# Altium schematic sheet MCU_NODE.SchDoc
size A
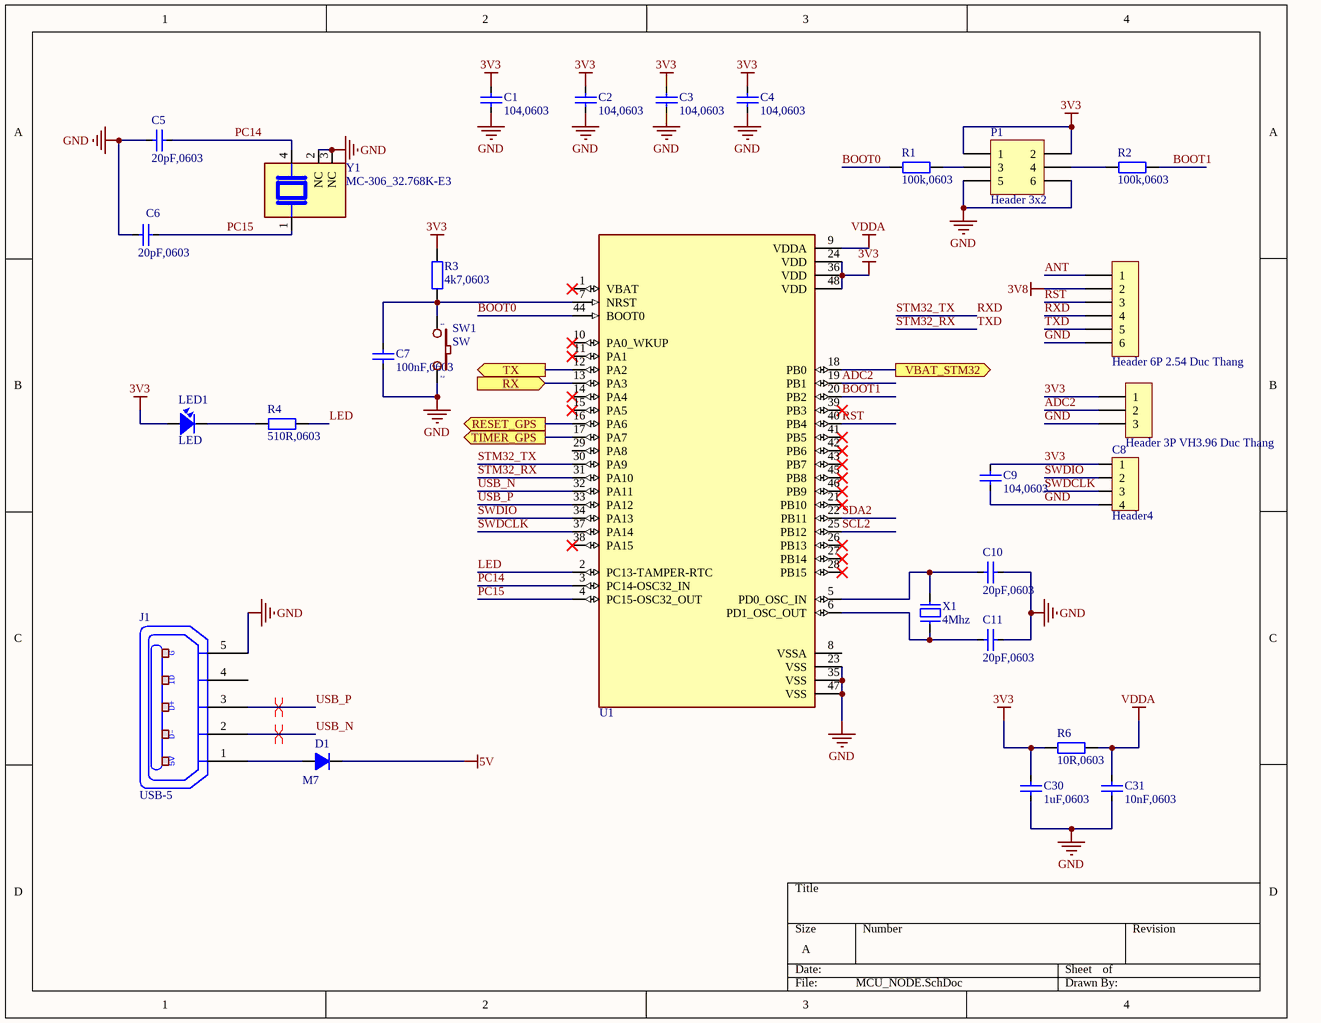
[diagram p0: MCU_NODE.SchDoc]

## Parts
C1  104,0603  [CAP_0603]
C2  104,0603  [CAP_0603]
C3  104,0603  [CAP_0603]
C4  104,0603  [CAP_0603]
C5  20pF,0603  [CAP_0603]
C6  20pF,0603  [CAP_0603]
C7  100nF,0603  [CAP_0603]
C8  Header4  [JP4-D1C]
C9  104,0603  [CAP_0603]
C10  20pF,0603  [CAP_0603]
C11  20pF,0603  [CAP_0603]
C30  1uF,0603  [CAP_0603]
C31  10nF,0603  [CAP_0603]
D1  M7  [SMA]
H1  Header 6P 2.54 Duc Thang  [XH2.54M-6]
H2  Header 3P VH3.96 Duc Thang  [VH3.96M-3]
J1  USB-5  [USB-M1]
LED1  LED  [LED-0805-Blue]
P1  Header 3x2  [Header 3x2]
R1  100k,0603  [RES-SMD-0603]
R2  100k,0603  [RES-SMD-0603]
R3  4k7,0603  [RES-SMD-0603]
R4  510R,0603  [RES-SMD-0603]
R6  10R,0603  [RES-SMD-0603]
SW1  SW  [SW-SMD]
U1  STM32  [LQFP 48]  (value not drawn)
X1  4Mhz  [XT2]
Y1  MC-306_32.768K-E3  [XTAL_MC-306_32.768K-E3]

## Ports
RESET_GPS (out), RX (in), TIMER_GPS (out), TX (out), VBAT_STM32 (out)

## Nets
3V3: C1.2 C2.2 C3.2 C4.2 C8.1 C9.2 C30.2 H2.1 LED1.1 P1.1 P1.2 R3.1 R6.1 U1.24(VDD) U1.36(VDD) U1.48(VDD)
3V8: H1.2
5V: D1.2(K)
GND: C1.1 C2.1 C3.1 C4.1 C5.1 C6.1 C7.1 C8.4 C9.1 C10.2 C11.2 C30.1 C31.1 H1.6 H2.3 J1.5(P5) P1.5 P1.6 SW1.2 U1.23(VSS) U1.35(VSS) U1.47(VSS) Y1.2(NC) Y1.3(NC)
VDDA: C31.2 R6.2 U1.9(VDDA)
ADC2: H2.2 U1.19(PB1)
ANT: H1.1
BOOT0: R1.1 U1.44(BOOT0)
BOOT1: R2.2 U1.20(PB2)
LED: R4.2 U1.2(PC13-TAMPER-RTC)
PC14: C5.2 U1.3(PC14-OSC32_IN) Y1.4
PC15: C6.2 U1.4(PC15-OSC32_OUT) Y1.1
RESET_GPS: U1.16(PA6) ; port RESET_GPS
RST: H1.3 U1.40(PB4)
RX: U1.13(PA3) ; port RX
RXD: H1.4 U1.30(PA9)  [also labelled STM32_TX]
SCL2: U1.25(PB12)
SDA2: U1.22(PB11)
STM32_RX: H1.5 U1.31(PA10)  [also labelled TXD]
SWDCLK: C8.3 U1.37(PA14)
SWDIO: C8.2 U1.34(PA13)
TIMER_GPS: U1.17(PA7) ; port TIMER_GPS
TX: U1.12(PA2) ; port TX
USB_N: J1.2(P2) U1.32(PA11)
USB_P: J1.3(P3) U1.33(PA12)
VBAT_STM32: U1.18(PB0) ; port VBAT_STM32
NetC7_2: C7.2 R3.2 SW1.1 U1.7(NRST)
NetC10_1: C10.1 U1.5(PD0_OSC_IN) X1.2
NetC11_1: C11.1 U1.6(PD1_OSC_OUT) X1.1
NetD1_1: D1.1(A) J1.1(P1)
NetLED1_2: LED1.2 R4.1
NetP1_3: P1.3 R1.2
NetP1_4: P1.4 R2.1

Not connected (* = marked no-connect by the designer): J1 4(P4); U1 1(VBAT)* 8(VSSA) 10(PA0_WKUP)* 11(PA1)* 14(PA4)* 15(PA5)* 21(PB10)* 26(PB13)* 27(PB14)* 28(PB15)* 29(PA8) 38(PA15)* 39(PB3)* 41(PB5)* 42(PB6)* 43(PB7)* 45(PB8)* 46(PB9)*

## Layout directives
differential pair: USB_N, USB_P

## Notes on the sheet
- (in symbol USB-5) G; ID; D+; D-; 5V

## Library data of the parts
C1-C7 C9-C11 C30 C31 = CapSMD: Capacitor; Value: 33p; Published: 8-Jun-2000; LatestRevisionDate: 17-Jul-2002; LatestRevisionNote: Re-released for DXP Platform.; PackageReference: RAD-0.3; Publisher: Altium Limited
C8 = Header4: Header IDC, 4 x 1 Pin Vertical 2.54mm Pitch (Non-Boxed, Male); Manufacturer: W¨¹rth Elektronik eiSos GmbH; partNo: 613002143121; ComponentLink1 Description: Manufacturer; ComponentLink2 Description: Datasheet; NoPins: 02; Created Date: 29 March 2013; ComponentLink1URL: http://www.we-online.com; ComponentLink2URL: http://katalog.we-online.de/em/datasheet/6130xx143121.pdf; Created by: Karrer Zheng
D1 = D1A: Diode 1A; Value: 1N4007
H1 = Header 6P 2.54 Duc Thang: Cắm; Ten_Linh_Kien: Header 6P XH2.54-6P Đực Thẳng; Don_Vi: Con; Ma_Hang: MH001972; Chung_Loai: Cắm
H2 = Header 3P VH3.96 Duc Thang: Cắm; Ten_Linh_Kien: Header 3P XH2.54-3P Đực Thẳng; Don_Vi: Con; Ma_Hang: MH001292; Chung_Loai: Cắm
J1 = USB-5: Manufacturer: FCI; Manufacturer Part Number: 10118193-0001LF; Connector Type: USB - micro B; Number of Contacts: 5; Gender: Receptacle; Specifications: USB 2.0; .Creator: MM; .Checked PCB: RF; Supplier 1: Digi-Key; RoHS: RoHS Compliant; Category: Connectors, Interconnects; Stock 1: 28642; Pricing 1: 1=0.46, 10=0.433, 25=0.3712, 50=0.3156, 100=0.3032, 250=0.27224, 500=0.25988 (USD); Packaging: Cut Tape (CT); Mounting Type: Surface Mount, Right Angle, Horizontal; Features: Shielded, Solder Retention; Ingress Protection: -; ComponentLink1URL: http://portal.fciconnect.com/Comergent//fci/drawing/10118193.pdf; ComponentLink1Description: http://portal.fciconnect.com/Comergent//fci/drawing/10118193.pdf; Supplier Part Number 1: 609-4616-1-ND; .Checked SCH: MM
LED1 = LED: LED Single colour Green and Red; Value: LED 3 ly Single Colour
P1 = Header 3x2: Header, 6-Pin, 2-Row; LatestRevisionDate: 17-Jul-2002; LatestRevisionNote: Re-released for DXP Platform.; Publisher: Altium Limited
R1-R4 R6 = Resistor - SMD: Resistor SMD; Manufacturer: Generic Components; Class: Passive; Published: 08/06/2000; Publisher: Altium Hobart Technology Centre
SW1 = SW2: Switch button 2 pin; Value: SW chip 2 pin
U1 = STM32F103C8T6: STM32 ARM-based 32-bit MCU with 64 Kbytes Flash, 64-pin LQFP, Industrial Temperature
X1 = XT2: Crystal For all Crystal 2pin.; Value: 4Mhz
Y1 = MC-306_32.768K-E3: CRYSTAL 32.7680KHZ 6PF SMD; MF: EPSON; MP: MC-306 32.768K-E3; Check_prices: https://www.snapeda.com/parts/MC-306%2032.768K-E3/EPSON/view-part/?ref=eda; Package: NON STANDARD-4 EPSON; Value: *; Price: None; Purchase-URL: https://pricing.snapeda.com/search/part/MC-306 32.768K-E3/?ref=eda; SnapEDA_Link: https://www.snapeda.com/parts/MC-306%2032.768K-E3/EPSON/view-part/?ref=snap; Availability: In Stock